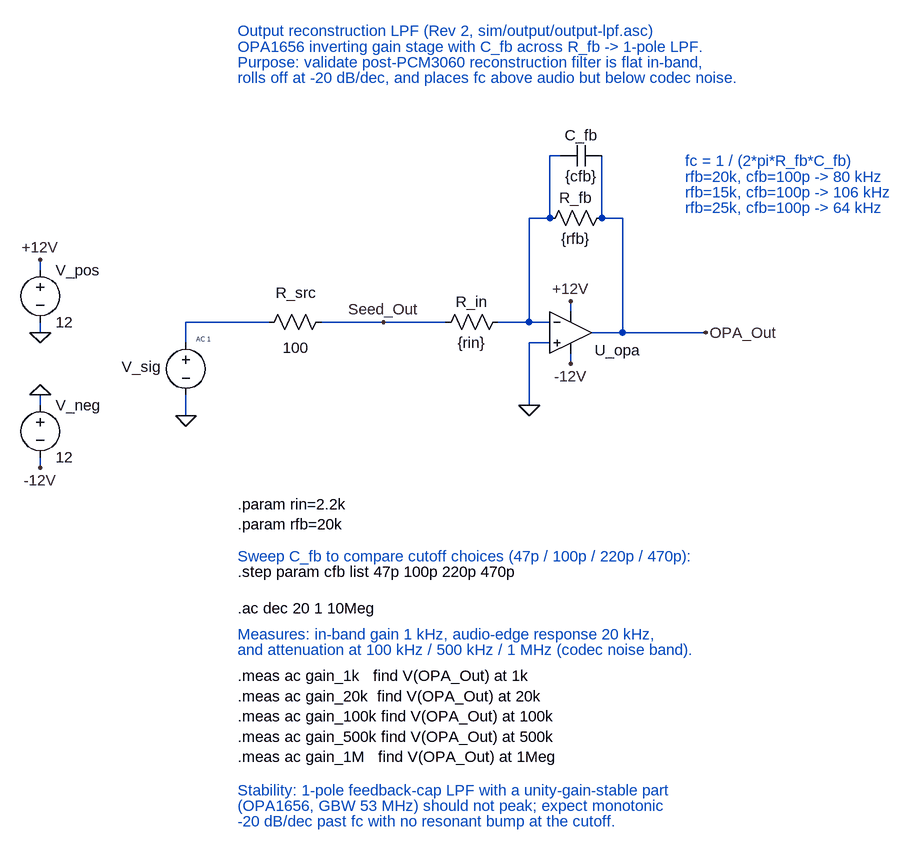
[diagram p0: schematic output-lpf.asc]
output-lpf.asc, the LTspice schematic file:
Version 4
SHEET 1 2220 1400
WIRE 368 144 352 144
WIRE 352 240 352 144
WIRE 352 240 320 240
WIRE 432 240 432 144
WIRE 464 240 432 240
WIRE -432 320 -432 304
WIRE 384 384 384 368
WIRE -80 400 -208 400
WIRE 96 400 0 400
WIRE 192 400 96 400
WIRE 320 400 320 240
WIRE 320 400 272 400
WIRE 352 400 320 400
WIRE -432 416 -432 400
WIRE 464 416 464 240
WIRE 464 416 416 416
WIRE 592 416 464 416
WIRE -208 432 -208 400
WIRE 352 432 320 432
WIRE 384 464 384 448
WIRE -432 528 -432 512
WIRE 320 528 320 432
WIRE -208 544 -208 512
WIRE -432 624 -432 608
FLAG -432 304 +12V
FLAG -432 416 0
FLAG -208 544 0
FLAG -432 624 -12V
FLAG -432 512 0
FLAG 320 528 0
FLAG 592 416 OPA_Out
FLAG 96 400 Seed_Out
FLAG 384 368 +12V
FLAG 384 464 -12V
SYMBOL voltage -432 304 R0
WINDOW 123 0 0 Left 0
WINDOW 39 0 0 Left 0
SYMATTR InstName V_pos
SYMATTR Value 12
SYMBOL voltage -432 512 R0
WINDOW 123 0 0 Left 0
WINDOW 39 0 0 Left 0
SYMATTR InstName V_neg
SYMATTR Value 12
SYMBOL voltage -208 416 R0
WINDOW 3 24 104 Invisible 2
WINDOW 123 16 10 Left 0
WINDOW 39 0 0 Left 0
WINDOW 0 -99 53 Left 2
SYMATTR Value ""
SYMATTR Value2 AC 1
SYMATTR InstName V_sig
SYMBOL res -96 416 R270
WINDOW 0 46 58 VTop 2
WINDOW 3 -8 57 VBottom 2
SYMATTR InstName R_src
SYMATTR Value 100
SYMBOL res 176 416 R270
WINDOW 0 32 56 VTop 2
WINDOW 3 0 56 VBottom 2
SYMATTR InstName R_in
SYMATTR Value {rin}
SYMBOL res 336 256 R270
WINDOW 0 32 56 VTop 2
WINDOW 3 0 56 VBottom 2
SYMATTR InstName R_fb
SYMATTR Value {rfb}
SYMBOL cap 432 128 R90
WINDOW 0 0 32 VBottom 2
WINDOW 3 32 32 VTop 2
SYMATTR InstName C_fb
SYMATTR Value {cfb}
SYMBOL UniversalOpAmp2 384 416 R0
WINDOW 0 37 27 Left 2
SYMATTR InstName U_opa
SYMATTR Value2 Avol=1Meg GBW=53Meg Slew=24Meg Vhigh=11 Vlow=-11
TEXT -128 -48 Left 2 ;Output reconstruction LPF (Rev 2, sim/output/output-lpf.asc)
TEXT -128 -24 Left 2 ;OPA1656 inverting gain stage with C_fb across R_fb -> 1-pole LPF.
TEXT -128 0 Left 2 ;Purpose: validate post-PCM3060 reconstruction filter is flat in-band,
TEXT -128 24 Left 2 ;rolls off at -20 dB/dec, and places fc above audio but below codec noise.
TEXT 560 152 Left 2 ;fc = 1 / (2*pi*R_fb*C_fb)
TEXT 560 176 Left 2 ;rfb=20k, cfb=100p -> 80 kHz
TEXT 560 200 Left 2 ;rfb=15k, cfb=100p -> 106 kHz
TEXT 560 224 Left 2 ;rfb=25k, cfb=100p -> 64 kHz
TEXT -128 680 Left 2 !.param rin=2.2k\n.param rfb=20k
TEXT -128 760 Left 2 ;Sweep C_fb to compare cutoff choices (47p / 100p / 220p / 470p):
TEXT -128 784 Left 2 !.step param cfb list 47p 100p 220p 470p
TEXT -128 840 Left 2 !.ac dec 20 1 10Meg
TEXT -128 880 Left 2 ;Measures: in-band gain 1 kHz, audio-edge response 20 kHz,
TEXT -128 904 Left 2 ;and attenuation at 100 kHz / 500 kHz / 1 MHz (codec noise band).
TEXT -128 944 Left 2 !.meas ac gain_1k   find V(OPA_Out) at 1k\n.meas ac gain_20k  find V(OPA_Out) at 20k\n.meas ac gain_100k find V(OPA_Out) at 100k\n.meas ac gain_500k find V(OPA_Out) at 500k\n.meas ac gain_1M   find V(OPA_Out) at 1Meg
TEXT -128 1120 Left 2 ;Stability: 1-pole feedback-cap LPF with a unity-gain-stable part
TEXT -128 1144 Left 2 ;(OPA1656, GBW 53 MHz) should not peak; expect monotonic
TEXT -128 1168 Left 2 ;-20 dB/dec past fc with no resonant bump at the cutoff.

The netlist it stands for:
* output-lpf.asc
V_pos +12V 0 12
V_neg 0 -12V 12
V_sig N002 0 AC 1
R_src N002 Seed_Out 100
R_in Seed_Out N001 {rin}
R_fb N001 OPA_Out {rfb}
C_fb OPA_Out N001 {cfb}
XU_opa 0 N001 +12V -12V OPA_Out level2 Avol=1Meg GBW=53Meg Slew=24Meg Vhigh=11 Vlow=-11 Ilimit=25m Rail=0 Vos=0 En=0 Enk=0 In=0 Ink=0 Rin=500Meg  ; pins In+ In- V+ V- OUT
* Output reconstruction LPF (Rev 2, sim/output/output-lpf.asc)
* OPA1656 inverting gain stage with C_fb across R_fb -> 1-pole LPF.
* Purpose: validate post-PCM3060 reconstruction filter is flat in-band,
* rolls off at -20 dB/dec, and places fc above audio but below codec noise.
* fc = 1 / (2*pi*R_fb*C_fb)
* rfb=20k, cfb=100p -> 80 kHz
* rfb=15k, cfb=100p -> 106 kHz
* rfb=25k, cfb=100p -> 64 kHz
.param rin=2.2k
.param rfb=20k
* Sweep C_fb to compare cutoff choices (47p / 100p / 220p / 470p):
.step param cfb list 47p 100p 220p 470p
.ac dec 20 1 10Meg
* Measures: in-band gain 1 kHz, audio-edge response 20 kHz,
* and attenuation at 100 kHz / 500 kHz / 1 MHz (codec noise band).
.meas ac gain_1k   find V(OPA_Out) at 1k
.meas ac gain_20k  find V(OPA_Out) at 20k
.meas ac gain_100k find V(OPA_Out) at 100k
.meas ac gain_500k find V(OPA_Out) at 500k
.meas ac gain_1M   find V(OPA_Out) at 1Meg
* Stability: 1-pole feedback-cap LPF with a unity-gain-stable part
* (OPA1656, GBW 53 MHz) should not peak; expect monotonic
* -20 dB/dec past fc with no resonant bump at the cutoff.
.lib UniversalOpAmp2.lib
.backanno
.end